# EAGLE design EEPROM-smt (EAGLE 7.6.0)
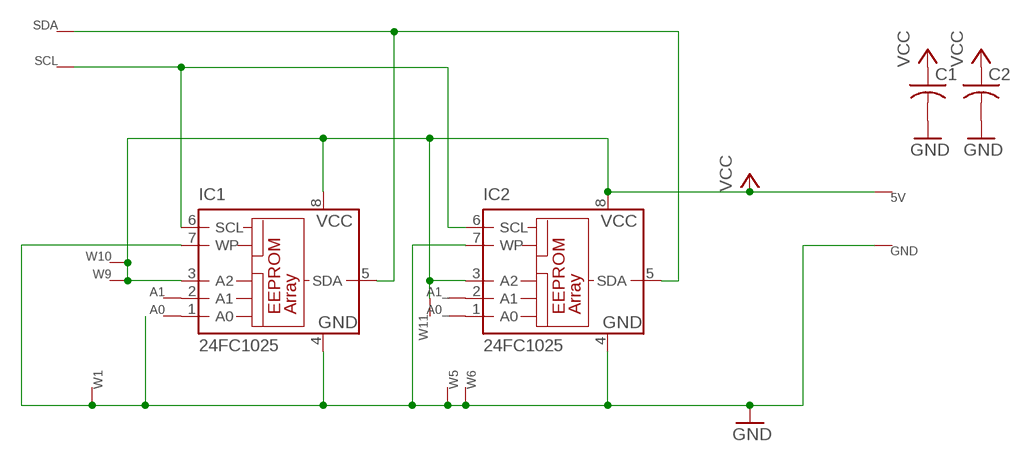
[diagram p0: schematic, sheet 1]

## Parts
5V  WIRE-VIA8  [VIA8]
A0  WIRE-R6  [VIA6]
A0_  WIRE-R6  [VIA6]
A1  WIRE-R6  [VIA6]
A1_  WIRE-R6  [VIA6]
C1  C-USC0805  [C0805]
C2  C-USC0805  [C0805]
GND  WIRE-VIA8  [VIA8]
IC1  24FC1025  24LC128SN  [SO-08]
IC2  24FC1025  24LC128SN  [SO-08]
SCL  WIRE-VIA8  [VIA8]
SDA  WIRE-VIA8  [VIA8]
W1  WIRE-VIA8  [VIA8]
W5  WIRE-VIA8  [VIA8]
W6  WIRE-VIA8  [VIA8]
W9  WIRE-VIA8  [VIA8]
W10  WIRE-VIA8  [VIA8]
W11  WIRE-VIA8  [VIA8]

## Nets
GND [power]: C1.2 C2.2 GND.P$1 IC1.4(GND) IC1.7(WP) IC2.4(GND) IC2.7(WP) W1.P$1 W5.P$1 W6.P$1
N$1: A1.P$1 IC1.2(A1)
N$2: A0.P$1 IC1.1(A0)
N$3: IC1.6(SCL) IC2.6(SCL) SCL.P$1
N$4: IC1.5(SDA) IC2.5(SDA) SDA.P$1
N$5: A1_.P$1 IC2.2(A1)
N$6: A0_.P$1 IC2.1(A0)
VCC [power]: 5V.P$1 C1.1 C2.1 IC1.3(A2) IC1.8(VCC) IC2.3(A2) IC2.8(VCC) W9.P$1 W10.P$1 W11.P$1

## Library data of the parts
5V A0 A0_ A1 A1_ GND SCL SDA W1 W5 W6 W9-W11 = mylib4:WIRE: Pad for a wire offboard
C1 C2 = my-rcl:C-US: CAPACITOR, American symbol
IC1 IC2 = microchip:24*: Serial EEPROM I2C; MF: MICROCHIP; MPN: 24LC128-I/SNG; OC_FARNELL: 9757937; OC_NEWARK: 30H1511

## Net classes
0 default: width 0.2 mm, drill 0.5 mm, clearance 0.25 mm
1 power: width 0.4 mm, drill 0.6 mm, clearance 0.25 mm

## Board
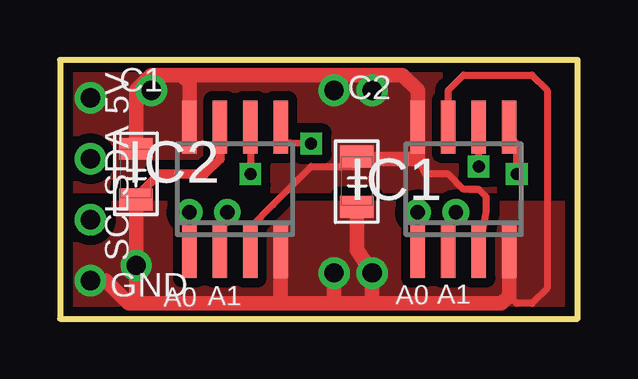
[diagram p1: board, top side]
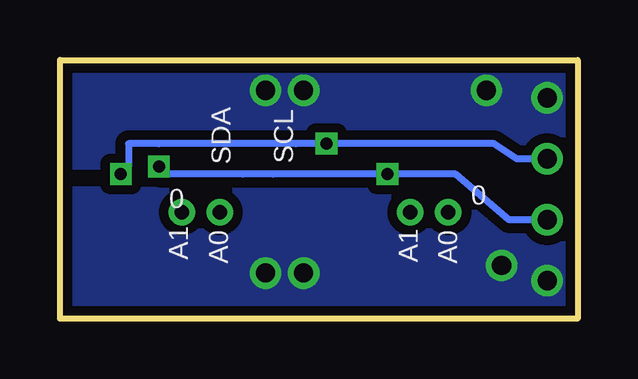
[diagram p2: board, bottom side, seen from below]

Size 21.59 x 10.79 mm. Coordinates in mm from the lower left corner, seen from the top.
Outline: 0,0 21.59,0 21.59,10.79 0,10.79 0,0
Copper layers (1*16): Top 0.035mm / dielectric 1.5mm / Bottom 0.035mm
Design rules "default *": minimum track width 10mil, minimum drill 24mil, track to track 8mil, track to pad 8mil, pad to pad 8mil, via to via 8mil, smd to smd 8mil, copper to edge 10mil, drill to drill 8mil, minimum pad ring 10mil, minimum via ring 8mil, stop-mask expansion 4mil, vias tented up to drill 0.75mm, thermal gap 10mil

### Footprints (pad centres in the part's own frame; a part is rotated, then mirrored left to right if it is on the bottom)
VIA8 = drill 0.8: P$1 0,0
VIA6 = drill 0.6: P$1 0,0
C0805 = smd 0.914 x 1.397: 1 -1.053,0; 2 1.053,0
SO-08 = smd 0.6 x 2.2: 1 -1.905,-2.6; 2 -0.635,-2.6; 3 0.635,-2.6; 4 1.905,-2.6; 5 1.905,2.6; 6 0.635,2.6; 7 -0.635,2.6; 8 -1.905,2.6

### Placement (x,y rotation side)
5V  1.27,9.21 180 top
A0  14.92,4.45 0 top
A0_  5.4,4.45 0 top
A1  16.51,4.45 0 top
A1_  6.98,4.45 0 top
C1  3.18,6.03 270 top
C2  12.38,5.71 270 top
GND  1.27,1.59 180 top
IC1  16.83,5.4 0 top
IC2  7.3,5.4 0 top
SCL  1.27,4.13 180 top
SDA  1.27,6.67 180 top
W1  13.02,1.9 0 top
W5  3.18,2.22 0 top
W6  11.43,1.9 0 top
W9  11.43,9.52 0 top
W10  3.81,9.52 0 top
W11  13.02,9.52 0 top

### Tracks (layer width: path | path; a pad name or v marks a point on that pad's centre or on a via)
GND
  Top 0.3: IC1.7 16.19,9.52 16.83,10.16 19.69,10.16 20.32,9.52 20.32,1.27 19.69,0.64 19.05,0.64 18.73,0.95
  Top 0.4: C1.2 3.18,5.08 4.13,6.03 6.03,6.03 6.67,6.67 IC2.7
  Top 0.6: GND.P$1 1.9,1.59 2.86,0.64 3.18,0.64 | 3.18,0.64 9.21,0.64 | 9.21,0.64 11.43,0.64 | 11.43,0.64 13.02,0.64 | 13.02,0.64 18.42,0.64 18.73,0.95 IC1.4 | IC2.4 9.21,0.64 | C1.2 W5.P$1 3.18,0.64 | W6.P$1 11.43,0.64 | 13.02,0.64 W1.P$1 12.38,2.86 C2.2
  pour Top (isolate 0.4, no thermals): -0.64,4.76 -0.64,-0.95 23.18,-0.95 23.18,4.76
  pour Bottom (isolate 0.4, no thermals): -0.64,5.4 -0.64,-0.63 22.54,-0.63 22.54,5.4
N$1
  Top 0.3: IC1.2 16.19,4.13 A1.P$1
N$2
  Top 0.3: IC1.1 14.92,4.76 A0.P$1
N$3  (via drill 0.5)
  Top 0.3: v17.46,6.35 IC1.6 | IC2.6 v7.94,6.03
  Bottom 0.3: SCL.P$1 2.86,4.13 5.08,6.03 v7.94,6.03 | v7.94,6.03 8.25,6.03 | 8.25,6.03 12.7,6.03 13.97,6.03 17.46,6.03 v17.46,6.35 | v7.94,6.03 8.25,6.03
N$4  (via drill 0.5)
  Top 0.3: IC2.5 9.27,7.36 v10.48,7.3 | v19.05,6.03 19.05,7.3 18.73,7.62 IC1.5
  Bottom 0.3: SDA.P$1 2.54,6.67 3.49,7.3 v10.48,7.3 | v10.48,7.3 11.75,7.3 | v10.48,7.3 11.75,7.3 | 11.75,7.3 17.46,7.3 18.73,7.3 18.73,6.35 v19.05,6.03
N$5
  Top 0.3: IC2.2 6.67,4.13 A1_.P$1
N$6
  Top 0.3: IC2.1 A0_.P$1
VCC
  Top 0.3: IC2.3 7.94,3.81 8.89,4.76 10.48,6.35 12.28,6.35 C2.1 | IC1.3 17.78,4.45 17.78,5.08 17.46,5.4 16.83,5.4 16.19,6.03 15.24,6.03 14.92,6.67
  Top 0.6: C1.1 3.18,9.52 3.81,10.16 5.08,10.16 | 5.08,10.16 12.38,10.16 14.29,10.16 14.92,9.52 IC1.8 14.92,6.67 14.6,6.67 12.48,6.67 C2.1 | IC2.8 5.4,9.84 5.08,10.16
  pour Top (isolate 0.4, no thermals): -0.64,11.75 -0.64,5.4 24.13,5.4 24.13,11.75
  pour Bottom (isolate 0.4, no thermals): -0.64,11.43 -0.64,6.35 22.23,6.35 22.23,11.43

### Text on the board
tPlace: A0 | A1 | A0 | A1
bPlace: SCL | SDA | 0 | 0 | A0 | A1 | A0 | A1